# EAGLE schematic Lighthouse Sensor Carrier (EAGLE 9.6.2)
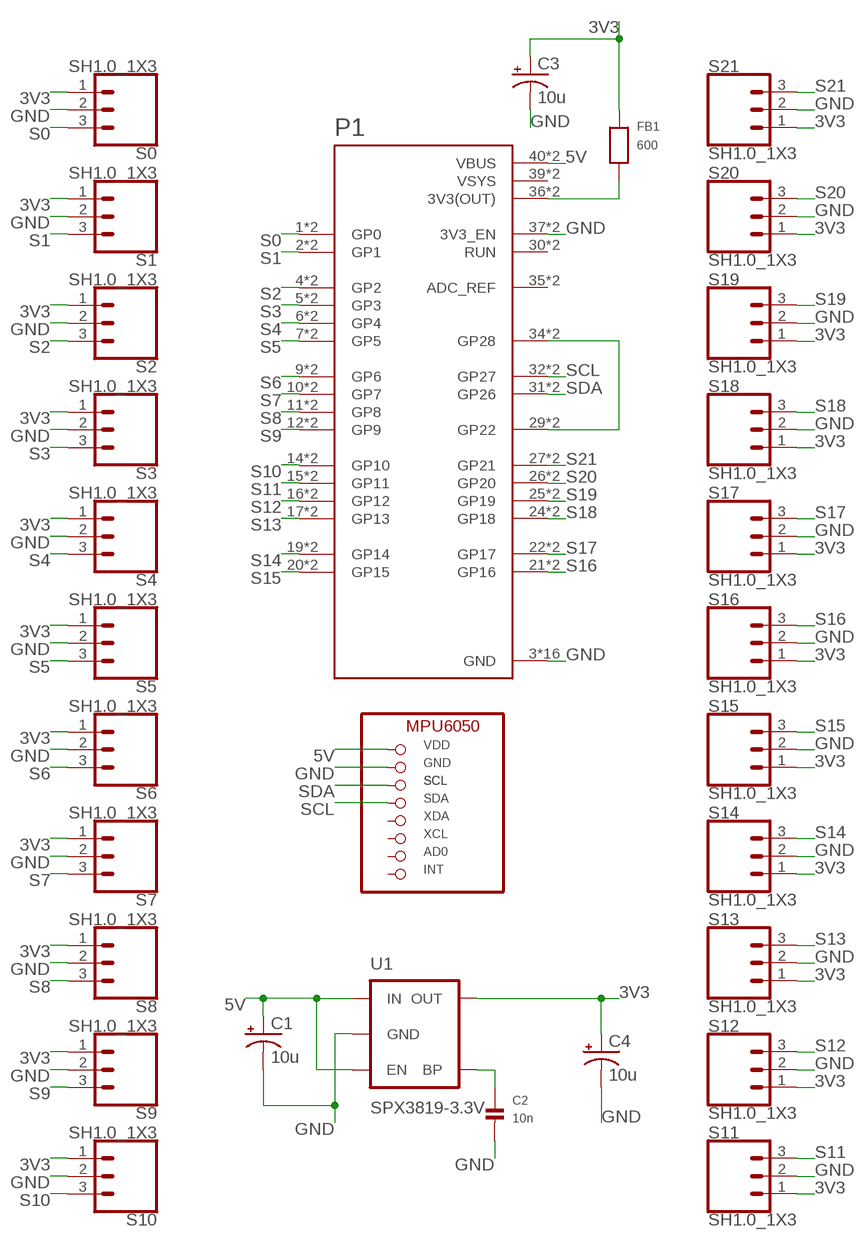
[diagram p0: schematic, sheet 1]

## Parts
C1  10u  CPOL-USA/3216-18R  [A/3216-18R]
C2  10n  CAP_CERAMIC0603  [0603]
C3  10u  CPOL-USA/3216-18R  [A/3216-18R]
C4  10u  CPOL-USA/3216-18R  [A/3216-18R]
FB1  600  RESISTOR_R0603  [R0603]
P1  RASPBERRY_PICO-NO_DEBUG  [PICO-PKG-NO_DEBUG]
S0  SH1.0_1X3  [1X03_1MM_RA]
S1  SH1.0_1X3  [1X03_1MM_RA]
S2  SH1.0_1X3  [1X03_1MM_RA]
S3  SH1.0_1X3  [1X03_1MM_RA]
S4  SH1.0_1X3  [1X03_1MM_RA]
S5  SH1.0_1X3  [1X03_1MM_RA]
S6  SH1.0_1X3  [1X03_1MM_RA]
S7  SH1.0_1X3  [1X03_1MM_RA]
S8  SH1.0_1X3  [1X03_1MM_RA]
S9  SH1.0_1X3  [1X03_1MM_RA]
S10  SH1.0_1X3  [1X03_1MM_RA]
S11  SH1.0_1X3  [1X03_1MM_RA]
S12  SH1.0_1X3  [1X03_1MM_RA]
S13  SH1.0_1X3  [1X03_1MM_RA]
S14  SH1.0_1X3  [1X03_1MM_RA]
S15  SH1.0_1X3  [1X03_1MM_RA]
S16  SH1.0_1X3  [1X03_1MM_RA]
S17  SH1.0_1X3  [1X03_1MM_RA]
S18  SH1.0_1X3  [1X03_1MM_RA]
S19  SH1.0_1X3  [1X03_1MM_RA]
S20  SH1.0_1X3  [1X03_1MM_RA]
S21  SH1.0_1X3  [1X03_1MM_RA]
U1  SPX3819-3.3V  V_REG_LDOSMD  [SOT23-5]
U$1  MPU6050BREAKOUT  [MPU6050]

## Nets
3V3 [POWER]: C3.+ C4.+ FB1.2 S0.1 S1.1 S2.1 S3.1 S4.1 S5.1 S6.1 S7.1 S8.1 S9.1 S10.1 S11.1 S12.1 S13.1 S14.1 S15.1 S16.1 S17.1 S18.1 S19.1 S20.1 S21.1 U1.5(OUT)
5V [POWER]: C1.+ P1.40(VBUS) P1.P$40(VBUS) U1.1(IN) U1.3(EN) U$1.VDD
GND: C1.- C2.2 C3.- C4.- P1.3(GND) P1.8(GND) P1.13(GND) P1.18(GND) P1.23(GND) P1.28(GND) P1.33(GND) P1.37(3V3_EN) P1.38(GND) P1.P$3(GND) P1.P$8(GND) P1.P$13(GND) P1.P$18(GND) P1.P$23(GND) P1.P$28(GND) P1.P$33(GND) P1.P$37(3V3_EN) P1.P$38(GND) S0.2 S1.2 S2.2 S3.2 S4.2 S5.2 S6.2 S7.2 S8.2 S9.2 S10.2 S11.2 S12.2 S13.2 S14.2 S15.2 S16.2 S17.2 S18.2 S19.2 S20.2 S21.2 U1.2(GND) U$1.GND
N$1: C2.1 U1.4(BP)
N$2: FB1.1 P1.36(3V3(OUT)) P1.P$36(3V3(OUT))
N$23: P1.29(GP22) P1.34(GP28) P1.P$29(GP22) P1.P$34(GP28)
S0: P1.1(GP0) P1.P$1(GP0) S0.3
S1: P1.2(GP1) P1.P$2(GP1) S1.3
S2: P1.4(GP2) P1.P$4(GP2) S2.3
S3: P1.5(GP3) P1.P$5(GP3) S3.3
S4: P1.6(GP4) P1.P$6(GP4) S4.3
S5: P1.7(GP5) P1.P$7(GP5) S5.3
S6: P1.9(GP6) P1.P$9(GP6) S6.3
S7: P1.10(GP7) P1.P$10(GP7) S7.3
S8: P1.11(GP8) P1.P$11(GP8) S8.3
S9: P1.12(GP9) P1.P$12(GP9) S9.3
S10: P1.14(GP10) P1.P$14(GP10) S10.3
S11: P1.15(GP11) P1.P$15(GP11) S11.3
S12: P1.16(GP12) P1.P$16(GP12) S12.3
S13: P1.17(GP13) P1.P$17(GP13) S13.3
S14: P1.19(GP14) P1.P$19(GP14) S14.3
S15: P1.20(GP15) P1.P$20(GP15) S15.3
S16: P1.21(GP16) P1.P$21(GP16) S16.3
S17: P1.22(GP17) P1.P$22(GP17) S17.3
S18: P1.24(GP18) P1.P$24(GP18) S18.3
S19: P1.25(GP19) P1.P$25(GP19) S19.3
S20: P1.26(GP20) P1.P$26(GP20) S20.3
S21: P1.27(GP21) P1.P$27(GP21) S21.3
SCL: P1.32(GP27) P1.P$32(GP27) U$1.SDA
SDA: P1.31(GP26) P1.P$31(GP26) U$1.SCL
Unconnected: P1.30(RUN) P1.35(ADC_REF) P1.P$30(RUN) P1.P$35(ADC_REF) U$1.AD0 U$1.INT U$1.XCL U$1.XDA

## Power pins joined to a net without a drawn wire
VSYS: P1.39(VSYS) P1.P$39(VSYS)

## Library data of the parts
C1 C3 C4 = Anran_adafruit:CPOL-US: POLARIZED CAPACITOR, American symbol
C2 = Anran_microbuilder:CAP_CERAMIC: Ceramic Capacitors 0402 - 0402 Surface Mount Capacitors 0603 - 0603 Surface Mount Capacitors 0805 - 0805 Surface Mount Capacitors 1206 - 1206 Surface Mount Capacitors
FB1 = Anran_microbuilder:RESISTOR: Resistors 0402 - 0402 Surface Mount Package 0603 - 0603 Surface Mount Package 0805 - 0805 Surface Mount Package 1206 - 1206 Surface Mount Package 2012 - 2010 Surface Mount Package
P1 = RpiPico:RASPBERRY_PICO-NO_DEBUG
S0 S1-S21 = customCON:SH1.0_1X3; SPICEPREFIX: J
U1 = SparkFun:V_REG_LDO: Voltage Regulator LDO Standard 150mA LDO voltage regulator in SOT-23 layout. Micrel part MIC5205. BP (by-pass) pin is used to lower output noise with 470pF cap.
U$1 = breakoutbrds:MPU6050BREAKOUT

## Net classes
0 default: width 0.152 mm, drill 0.3 mm, clearance 0.152 mm
1 POWER: width 0.305 mm, drill 0.3 mm, clearance 0.152 mm